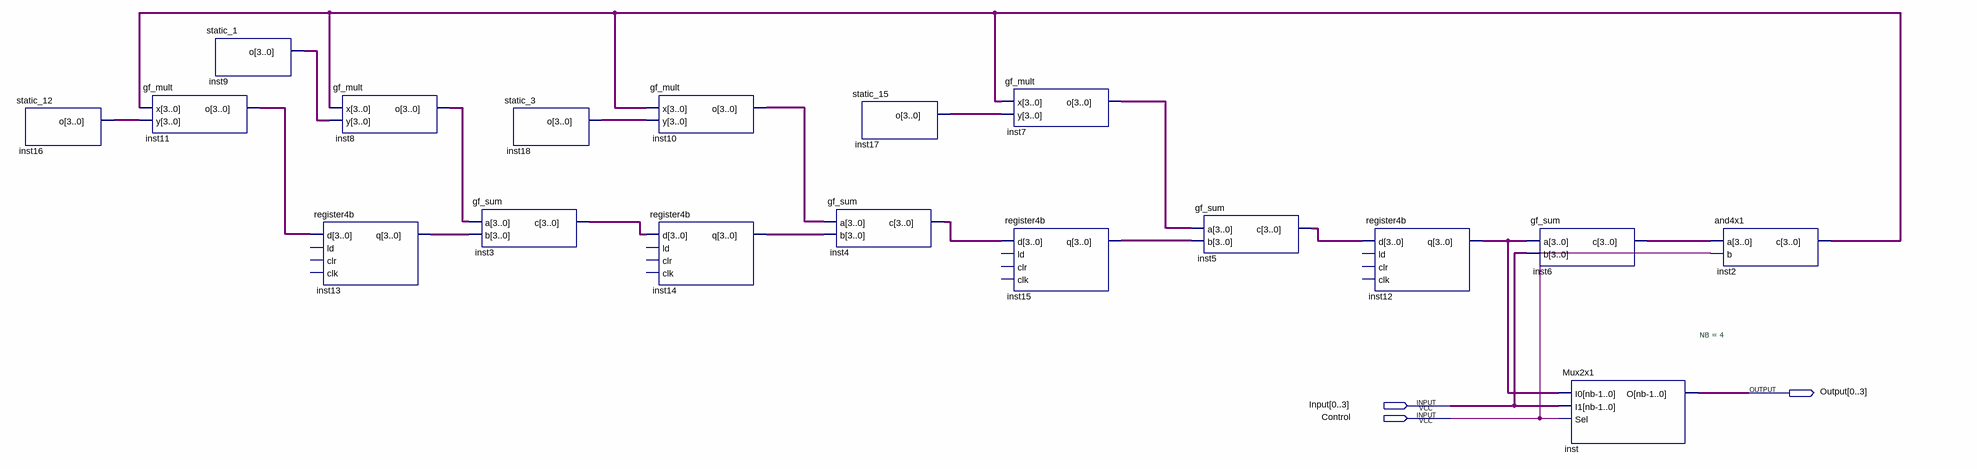
[diagram p0: schematic sheet]
// Quartus schematic Block1.bdf as structural Verilog: 18 symbols, 3 pins
module Block1 (
  input  [0:3] Input,
  input  Control,
  output [0:3] Output
);

  wire [3:0] inst2_c, inst3_c, inst4_c, inst5_c, inst6_c, inst7_o, inst8_o, inst9_o, inst10_o, inst11_o,
       inst12_q, inst13_q, inst14_q, inst15_q, inst16_o, inst17_o, inst18_o;

  static_12 inst16 (.o(inst16_o));
  gf_mult inst11 (.x(inst2_c), .y(inst16_o), .o(inst11_o));
  static_1 inst9 (.o(inst9_o));
  gf_mult inst8 (.x(inst2_c), .y(inst9_o), .o(inst8_o));
  register4b inst13 (.d(inst11_o), .q(inst13_q));  // open: ld, clr, clk
  gf_sum inst3 (.a(inst8_o), .b(inst13_q), .c(inst3_c));
  static_3 inst18 (.o(inst18_o));
  gf_mult inst10 (.x(inst2_c), .y(inst18_o), .o(inst10_o));
  register4b inst14 (.d(inst3_c), .q(inst14_q));  // open: ld, clr, clk
  gf_sum inst4 (.a(inst10_o), .b(inst14_q), .c(inst4_c));
  static_15 inst17 (.o(inst17_o));
  gf_mult inst7 (.x(inst2_c), .y(inst17_o), .o(inst7_o));
  register4b inst15 (.d(inst4_c), .q(inst15_q));  // open: ld, clr, clk
  gf_sum inst5 (.a(inst7_o), .b(inst15_q), .c(inst5_c));
  register4b inst12 (.d(inst5_c), .q(inst12_q));  // open: ld, clr, clk
  gf_sum inst6 (.a(inst12_q), .b(Input), .c(inst6_c));
  Mux2x1 #(.NB(4)) inst (.I0(inst12_q), .I1(Input), .Sel(Control), .O(Output));
  and4x1 inst2 (.a(inst6_c), .b(Control), .c(inst2_c));
endmodule
